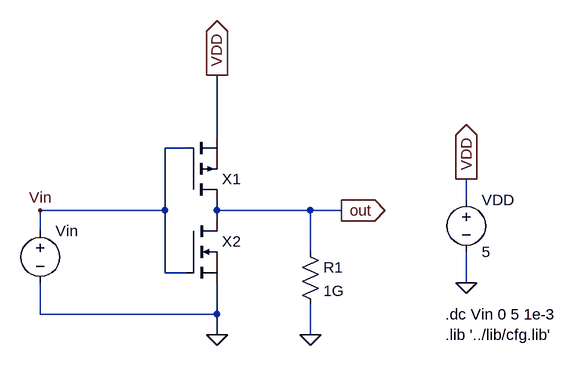
[diagram p0: schematic not-d1[dc].asc]
not-d1[dc].asc, the LTspice schematic file:
Version 4
SHEET 1 968 680
WIRE 176 32 176 -64
WIRE 128 48 96 48
WIRE 560 128 560 96
WIRE 96 144 96 48
WIRE 96 144 -96 144
WIRE 176 144 176 128
WIRE 320 144 176 144
WIRE 368 144 320 144
WIRE 176 160 176 144
WIRE -96 176 -96 144
WIRE 320 208 320 144
WIRE 96 240 96 144
WIRE 128 240 96 240
WIRE 560 256 560 208
WIRE -96 304 -96 256
WIRE 176 304 176 256
WIRE 176 304 -96 304
WIRE 176 336 176 304
WIRE 320 336 320 288
FLAG 176 336 0
FLAG 560 256 0
FLAG 368 144 out
IOPIN 368 144 Out
FLAG 560 96 VDD
IOPIN 560 96 Out
FLAG 176 -64 VDD
IOPIN 176 -64 Out
FLAG -96 144 Vin
FLAG 320 336 0
SYMBOL voltage 560 112 R0
WINDOW 123 0 0 Left 2
WINDOW 39 0 0 Left 2
SYMATTR InstName VDD
SYMATTR Value 5
SYMBOL voltage -96 160 R0
WINDOW 123 0 0 Left 2
WINDOW 39 0 0 Left 2
SYMATTR InstName Vin
SYMATTR Value ""
SYMBOL res 304 192 R0
SYMATTR InstName R1
SYMATTR Value 1G
SYMBOL pmos 128 128 M180
WINDOW 3 56 72 Invisible 2
SYMATTR Value pmos_t2
SYMATTR InstName X1
SYMATTR Prefix X
SYMBOL nmos 128 160 R0
WINDOW 3 56 72 Invisible 2
SYMATTR Value nmos_t2
SYMATTR InstName X2
SYMATTR Prefix X
TEXT 528 336 Left 2 !.lib '../lib/cfg.lib'
TEXT 528 304 Left 2 !.dc Vin 0 5 1e-3

The netlist it stands for:
* not-d1[dc].asc
VDD VDD 0 5
Vin Vin 0
R1 out 0 1G
XX1 out Vin VDD pmos_t2  ; pins D G S
XX2 out Vin 0 nmos_t2  ; pins D G S
.lib '../lib/cfg.lib'
.dc Vin 0 5 1e-3
.backanno
.end